# Altium schematic sheet Low Distortion Oscillator.Amp2.SchDoc
size A4
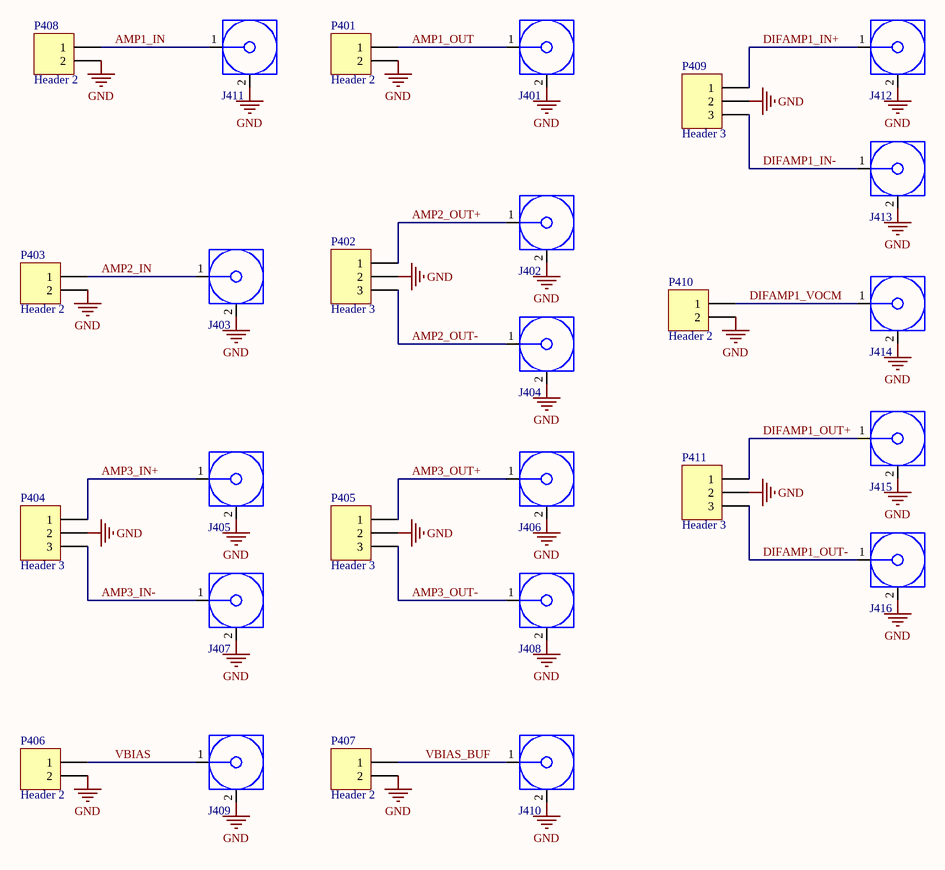
[diagram p0: Low Distortion Oscillator.Amp2.SchDoc]

## Parts
J401  SMA  [SMA-2]  (value not drawn)
J402  SMA  [SMA-2]  (value not drawn)
J403  SMA  [SMA-2]  (value not drawn)
J404  SMA  [SMA-2]  (value not drawn)
J405  SMA  [SMA-2]  (value not drawn)
J406  SMA  [SMA-2]  (value not drawn)
J407  SMA  [SMA-2]  (value not drawn)
J408  SMA  [SMA-2]  (value not drawn)
J409  SMA  [SMA-2]  (value not drawn)
J410  SMA  [SMA-2]  (value not drawn)
J411  SMA  [SMA-2]  (value not drawn)
J412  SMA  [SMA-2]  (value not drawn)
J413  SMA  [SMA-2]  (value not drawn)
J414  SMA  [SMA-2]  (value not drawn)
J415  SMA  [SMA-2]  (value not drawn)
J416  SMA  [SMA-2]  (value not drawn)
P401  Header 2  [HDR1X2]
P402  Header 3  [HDR1X3]
P403  Header 2  [HDR1X2]
P404  Header 3  [HDR1X3]
P405  Header 3  [HDR1X3]
P406  Header 2  [HDR1X2]
P407  Header 2  [HDR1X2]
P408  Header 2  [HDR1X2]
P409  Header 3  [HDR1X3]
P410  Header 2  [HDR1X2]
P411  Header 3  [HDR1X3]

## Nets
GND: J401.2(GND) J402.2(GND) J403.2(GND) J404.2(GND) J405.2(GND) J406.2(GND) J407.2(GND) J408.2(GND) J409.2(GND) J410.2(GND) J411.2(GND) J412.2(GND) J413.2(GND) J414.2(GND) J415.2(GND) J416.2(GND) P401.2 P402.2 P403.2 P404.2 P405.2 P406.2 P407.2 P408.2 P409.2 P410.2 P411.2
AMP1_IN: J411.1(Signal) P408.1
AMP1_OUT: J401.1(Signal) P401.1
AMP2_IN: J403.1(Signal) P403.1
AMP2_OUT+: J402.1(Signal) P402.1
AMP2_OUT-: J404.1(Signal) P402.3
AMP3_IN+: J405.1(Signal) P404.1
AMP3_IN-: J407.1(Signal) P404.3
AMP3_OUT+: J406.1(Signal) P405.1
AMP3_OUT-: J408.1(Signal) P405.3
DIFAMP1_IN+: J412.1(Signal) P409.1
DIFAMP1_IN-: J413.1(Signal) P409.3
DIFAMP1_OUT+: J415.1(Signal) P411.1
DIFAMP1_OUT-: J416.1(Signal) P411.3
DIFAMP1_VOCM: J414.1(Signal) P410.1
VBIAS: J409.1(Signal) P406.1
VBIAS_BUF: J410.1(Signal) P407.1

## Library data of the parts
P401 P403 P406-P408 P410 = Header 2: Header, 2-Pin
P402 P404 P405 P409 P411 = Header 3: Header, 3-Pin